# Altium schematic sheet CC6201ST.schdoc
size 49 x 35 mm
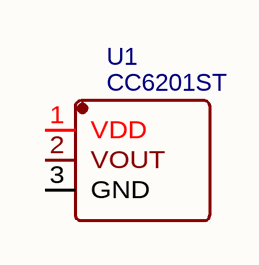
[diagram p0: CC6201ST.schdoc]

## Parts
U1  CC6201ST  [SOT-23-3_L2.9-W1.3-P1.90-LS2.4-BR]

## Nets

Not connected (* = marked no-connect by the designer): U1 1(VDD) 2(VOUT) 3(GND)

## Library data of the parts
U1 = CC6201ST: BOM_Manufacturer: Cross chip; Contributor: LCSC; BOM_Supplier: LCSC; BOM_Supplier Part: C285995; BOM_Manufacturer Part: CC6201ST; BOM_JLCPCB Part Class: Extended Part; spicePre: U; spiceSymbolName: CC6201ST